# EAGLE design SkyProbe Main REV1A (EAGLE 7.4.0)
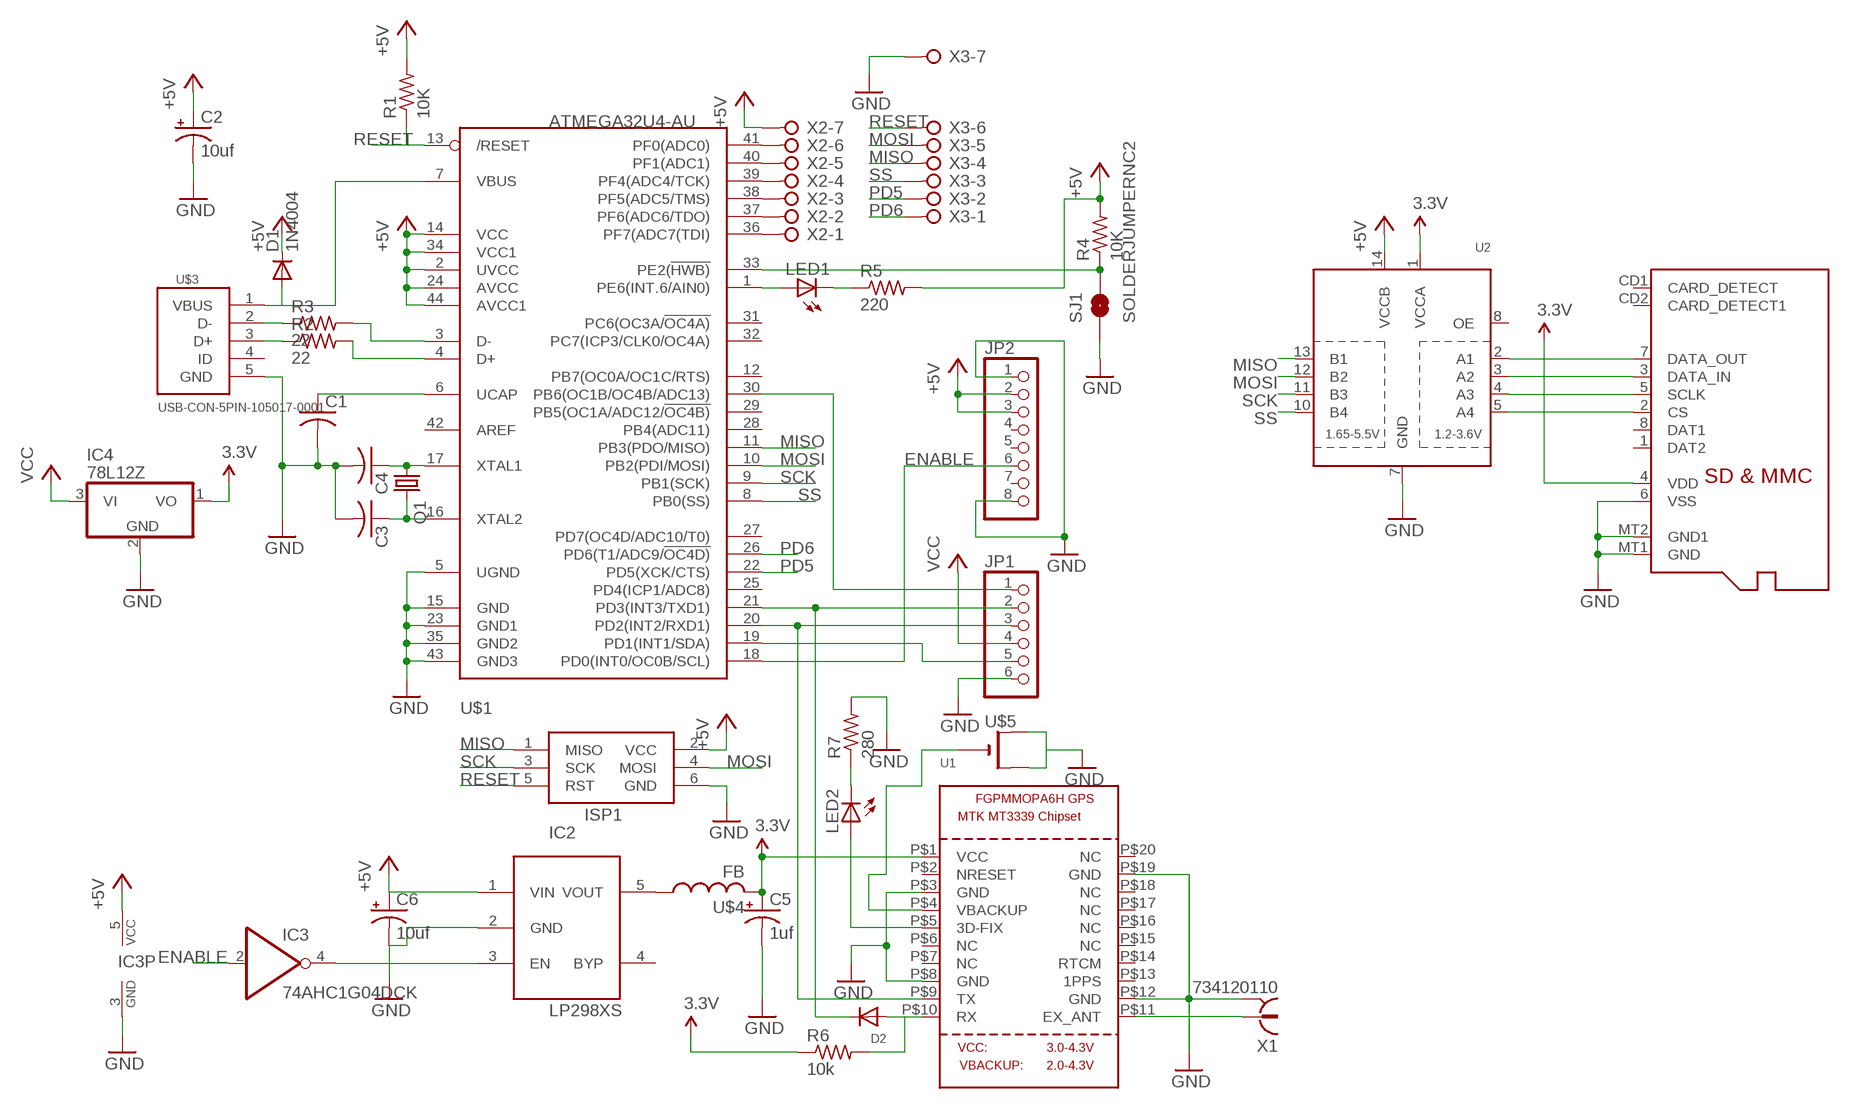
[diagram p0: schematic, sheet 1]

## Parts
C1  C-USC0805  [C0805]
C2  10uf  CPOL-US140CLH-0810  [140CLH-0810]
C3  C-USC0805  [C0805]
C4  C-USC0805  [C0805]
C5  1uf  CAP_POLSMD  [VISHAY_C]
C6  10uf  CAP_POLSMD  [VISHAY_C]
D1  1N4004  [DO41-10]
D2  DIODESOT23_WAVE  [SOT23-W]
IC2  LP298XS  [SOT23-5L]
IC3  74AHC1G04DCK  [SC70-5]
IC4  78L12Z  [TO92]
ISP1  AVRISP-6  [AVRISP]
JP1  PINHD-1X6  [1X06]
JP2  PINHD-1X8CLEANBIG  [1X08-CLEANBIG]
LED1  LEDB155  [Q62902-B155]
LED2  LEDCHIPLED_0603  [CHIPLED_0603]
Q1  CRYSTALCTS406  [CTS406]
R1  10K  R-US_R0805  [R0805]
R2  22  R-US_R0805  [R0805]
R3  22  R-US_R0805  [R0805]
R4  10K  R-US_R0805  [R0805]
R5  220  R-US_R0805  [R0805]
R6  10k  R-US_M0805  [M0805]
R7  280  R-US_M0805  [M0805]
SJ1  SOLDERJUMPERNC2  [SJ_2S-NOTRACE]
U1  GPS_FGPMMOPA6H  [FGPMMOPA6H]
U2  TXB0104PWR  [TSSOP14]
U$1  ATMEGA32U4-AU  [TQFP44]
U$3  USB-CON-5PIN-105017-0001  [USB-MICRO-MOLEX-105017-0001]
U$4  FB  [FB]
U$5  CR1220SMT  [CR1220-SMD]
U$6  MICROSD  [MICROSD]
X1  734120110  [734120110]
X2  W237-07P  [W237-7P]
X3  W237-07P  [W237-7P]

## Nets
3.3V: C5.+ IC4.1(VO) R6.1 U1.P$1(VCC) U2.1(VCCA) U$4.P$2
+5V: C2.+ C6.+ D1.C IC2.1(VIN) IC3.5(VCC) ISP1.2(VCC) JP2.2 JP2.3 R1.2 R4.2 R5.2 U2.14(VCCB) U$1.2(UVCC) U$1.14(VCC) U$1.24(AVCC) U$1.34(VCC1) U$1.44(AVCC1) X2.7
ENABLE: IC3.2(I) JP2.6 U$1.18(PD0(INT0/OC0B/SCL))
GND: C1.2 C2.- C3.2 C4.2 C5.- C6.- IC2.2(GND) IC3.3(GND) IC4.2(GND) ISP1.6(GND) JP1.6 JP2.1 JP2.8 R7.2 SJ1.1 U1.P$3(GND) U1.P$8(GND) U1.P$12(GND) U1.P$19(GND) U2.7(GND) U$1.5(UGND) U$1.15(GND) U$1.23(GND1) U$1.35(GND2) U$1.43(GND3) U$3.5(GND) U$5.+$1(+) U$5.+$2(+1) U$6.6(VSS) U$6.MT1(GND) U$6.MT2(GND1) X1.S@1 X1.S@2 X1.S@3 X3.7
MISO: ISP1.1(MISO) U2.13(B1) U$1.11(PB3(PDO/MISO)) X3.4
MOSI: ISP1.4(MOSI) U2.12(B2) U$1.10(PB2(PDI/MOSI)) X3.5
N$1: C1.1 U$1.6(UCAP)
N$2: R2.1 U$3.3(D+)
N$3: R3.2 U$1.3(D-)
N$4: C4.1 Q1.1 U$1.17(XTAL1)
N$5: C3.1 Q1.3 U$1.16(XTAL2)
N$6: R2.2 U$1.4(D+)
N$7: R3.1 U$3.2(D-)
N$8: D1.A U$1.7(VBUS) U$3.1(VBUS)
N$9: D2.3(C) JP1.2 U$1.21(PD3(INT3/TXD1))
N$10: JP1.3 U1.P$9(TX) U$1.20(PD2(INT2/RXD1))
N$11: R4.1 SJ1.2 U$1.33(PE2(!HWB))
N$12: JP1.5 U$1.19(PD1(INT1/SDA))
N$13: JP1.1 U$1.30(PB6(OC1B/OC4B/ADC13))
N$14: LED1.A U$1.1(PE6(INT.6/AIN0))
N$15: LED1.K(C) R5.1
N$16: D2.1(A) R6.2 U1.P$10(RX)
N$17: U$1.41(PF0(ADC0)) X2.6
N$18: U$1.40(PF1(ADC1)) X2.5
N$19: U$1.39(PF4(ADC4/TCK)) X2.4
N$20: U$1.38(PF5(ADC5/TMS)) X2.3
N$21: U$1.37(PF6(ADC6/TDO)) X2.2
N$22: U$1.36(PF7(ADC7(TDI)) X2.1
N$23: U1.P$4(VBACKUP) U$5.-
N$24: IC2.5(VOUT) U$4.P$1
N$25: U1.P$11(EX_ANT) X1.1
N$26: LED2.A U1.P$5(3D-FIX)
N$27: LED2.C R7.1
N$28: IC2.3(EN) IC3.4(O)
N$29: U2.2(A1) U$6.7(DATA_OUT)
N$30: U2.3(A2) U$6.3(DATA_IN)
N$31: U2.4(A3) U$6.5(SCLK)
N$32: U2.5(A4) U$6.2(CS)
PD5: U$1.22(PD5(XCK/CTS)) X3.2
PD6: U$1.26(PD6(T1/ADC9/!OC4D)) X3.1
RESET: ISP1.5(RST) R1.1 U$1.13(/RESET) X3.6
SCK: ISP1.3(SCK) U2.11(B3) U$1.9(PB1(SCK))
SS: U2.10(B4) U$1.8(PB0(SS)) X3.3
VCC: IC4.3(VI) JP1.4
VDD: U$6.4(VDD) ; supply symbol labelled 3.3V
Unconnected: IC2.4(BYP) JP2.4 JP2.5 JP2.7 U1.P$2(NRESET) U1.P$6(NC) U1.P$7(NC) U1.P$13(1PPS) U1.P$14(RTCM) U1.P$15(NC) U1.P$16(NC) U1.P$17(NC) U1.P$18(NC) U1.P$20(NC) U2.8(OE) U$1.12(PB7(OC0A/OC1C/RTS)) U$1.25(PD4(ICP1/ADC8)) U$1.27(PD7(OC4D/ADC10/T0)) U$1.28(PB4(ADC11)) U$1.29(PB5(OC1A/ADC12/!OC4B)) U$1.31(PC6(OC3A/!OC4A)) U$1.32(PC7(ICP3/CLK0/OC4A)) U$1.42(AREF) U$3.4(ID) U$6.1(DAT2) U$6.8(DAT1) U$6.CD1(CARD_DETECT) U$6.CD2(CARD_DETECT1)

## Library data of the parts
C1 C3 C4 = rcl:C-US: CAPACITOR, American symbol
C2 = rcl:CPOL-US: POLARIZED CAPACITOR, American symbol
C5 C6 = SparkFun-Capacitors:CAP_POL: Capacitor Polarized These are standard SMD and PTH capacitors. Normally 10uF, 47uF, and 100uF in electrolytic and tantalum varieties. Always verify the external diameter of the through hole cap, it varies with capacity, voltage, and manufacturer. The EIA devices should be standard.
D1 = adafruit:1N4004: DIODE General purpose 1N400x type rectifier (With bigger pads) http://www.ladyada.net/library/pcb/eaglelibrary.html
D2 = adafruit:DIODE: Diode SMADIODE - SMA Surface Mount Package 20V 1A Schottky Diode Digikey: 641-1014-6-ND DO-1N4148 - Through Hole Small Current Diode SOD-123 20V 1 A (.5mV Vf) Schottky Diode - Digikey: MBRX120TPMSCT-ND SOD-323 10V 570mA (.38mV Vf, 3ns) Schottky Diode - Digikey: ZLLS410CT-ND SOD-523 30V 30mA Schottky Diode (RB751S-40TE61) - Digikey: RB751S-40TE61CT-ND SOT23-R/W - SOT23 Package (R = Solder Paste/Reflow Ovens, W = Hand-Soldering) BAT54Film 40V 300mA - Digikey: 497-7162-1-ND
IC2 = adafruit:LP298X
IC3 = 74xx-little-de:74*1G04: INVERTER Gate
IC4 = adafruit:78*: Positive VOLTAGE REGULATOR Added bigger pads to the TO-92 package
ISP1 = adafruit:AVRISP: AVR ISP HEADER Standard 6 pin header for AVR programming
JP1 = adafruit:PINHD-1X6: PIN HEADER
JP2 = adafruit:PINHD-1X8: PIN HEADER
LED1 LED2 = adafruit:LED: LED OSRAM: - CHIPLED LG R971, LG N971, LY N971, LG Q971, LY Q971, LO R971, LY R971 LH N974, LH R974 LS Q976, LO Q976, LY Q976 LO Q996 - Hyper CHIPLED LW Q18S LB Q993, LB Q99A, LB R99A - SideLED LS A670, LO A670, LY A670, LG A670, LP A670 LB A673, LV A673, LT A673, LW A673 LH A674 LY A675 LS A676, LA A676, LO A676, LY A676, LW A676 LS A679, LY A679, LG A679 - Hyper Micro SIDELED® LS Y876, LA Y876, LO Y876, LY Y876 LT Y87S - SmartLED LW L88C, LW L88S LB L89C, LB L89S, LG L890 LS L89K, LO L89K, LY L89K LS L896, LA L896, LO L896, LY L896 - TOPLED LS T670, LO T670, LY T670, LG T670, LP T670 LSG T670, LSP T670, LSY T670, LOP T670, LYG T670 LG T671, LOG T671, LSG T671 LB T673, LV T673, LT T673, LW T673 LH T674 LS T676, LA T676, LO T676, LY T676, LB T676, LH T676, LSB T676, LW T676 LB T67C, LV T67C, LT T67C, LS T67K, LO T67K, LY T67K, LW E67C LS E67B, LA E67B, LO E67B, LY E67B, LB E67C, LV E67C, LT E67C LW T67C LS T679, LY T679, LG T679 LS T770, LO T770, LY T770, LG T770, LP T770 LB T773, LV T773, LT T773, LW T773 LH T774 LS E675, LA E675, LY E675, LS T675 LS T776, LA T776, LO T776, LY T776, LB T776 LHGB T686 LT T68C, LB T68C - Hyper Mini TOPLED® LB M676 - Mini TOPLED Santana® LG M470 LS M47K, LO M47K, LY M47K Source: http://www.osram.convergy.de/
Q1 = adafruit:CRYSTAL: CRYSTAL; OC_FARNELL: unknown; OC_NEWARK: unknown
R1-R7 = rcl:R-US_: RESISTOR, American symbol
SJ1 = SparkFun-Retired:SOLDERJUMPER: Solder Jumper Standard SMD solder jumper. Used to automate production. Two varients : Normally Open and Normally Closed are the same, but have different paste layers. NC will have a large amount of paste and should jumper during reflow.
U1 = adafruit:GPS_FGPMMOPA6H: GPS Module - MTK MT3339 Chipset, -165dBm sensitivity, 22 channels, 10Hz, auto-select external antenna options
U2 = adafruit:TXB0104PWR: 4-Bit Bi-Directional Level Shifter 1.2V-3.6V (VCCA) to 1.65V-5.5V (VCCB) bi-directional level shifter with auto direction sensing. Max data rate - VCCA 1.8V: 20Mbps (50ns), VCCA 3.3V: 100Mbps (10ns) Digikey: 296-21929-1-ND
U$1 = adafruit:ATMEGA32U4: http://www.ladyada.net/library/eagle
U$3 = GeekAmmo:USB-CON-5PIN: Molex Micro USB 105017-0001
U$4 = adafruit:FB: Ferrite bead Digikey #P9821BK-ND
U$5 = adafruit:CR1220: CR1216/CR1220/CR1225 12mm 3V lithium coin cell Great for battery packup. Both SMT and THM holders. Note the THM package has the ground pads on both sides of the PCB so that the masks are the same - this reduces the cost
U$6 = adafruit:MICROSD: Micro-SD / Transflash card holder with SPI pinout For the 3M # 2908-05WB-MG and/or 4UCON #19656 push-push type
X1 = con-coax:734120110: MICRO COAXIAL CONNECTOR RECEPTACLE VERTICAL Source: Data sheet <http://www.molex.com/pdm_docs/sd/734120110_sd.pdf>
X2 X3 = con-wago-508:W237-07P: WAGO SREW CLAMP; OC_FARNELL: unknown; OC_NEWARK: unknown

## Board
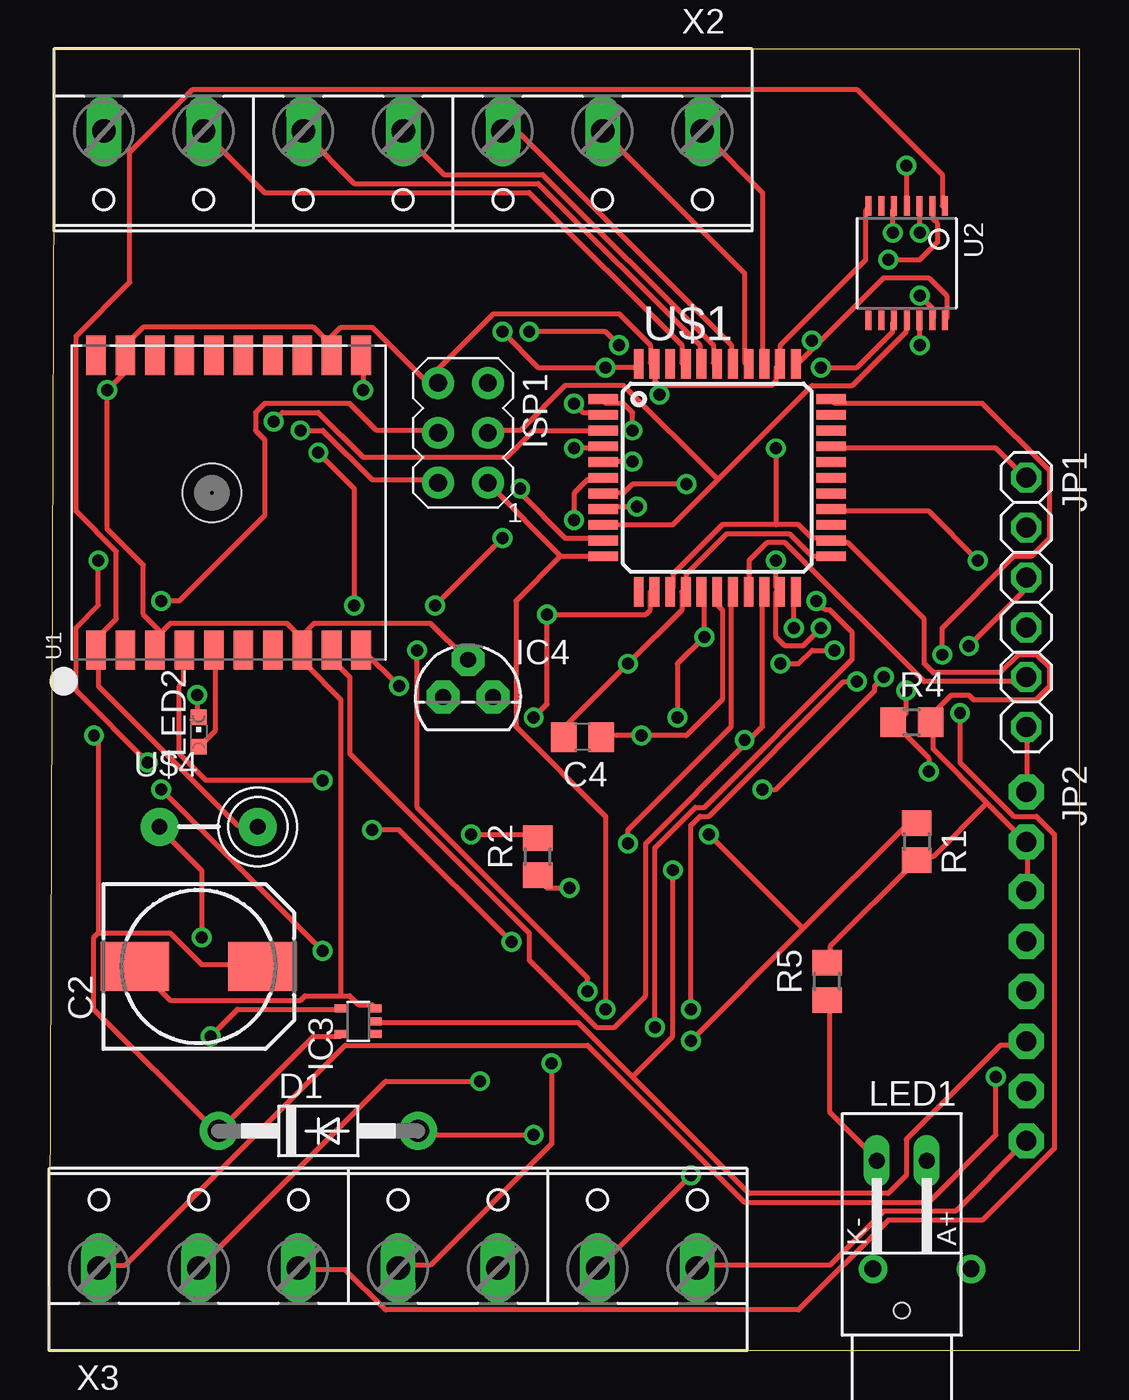
[diagram p1: board, top side]
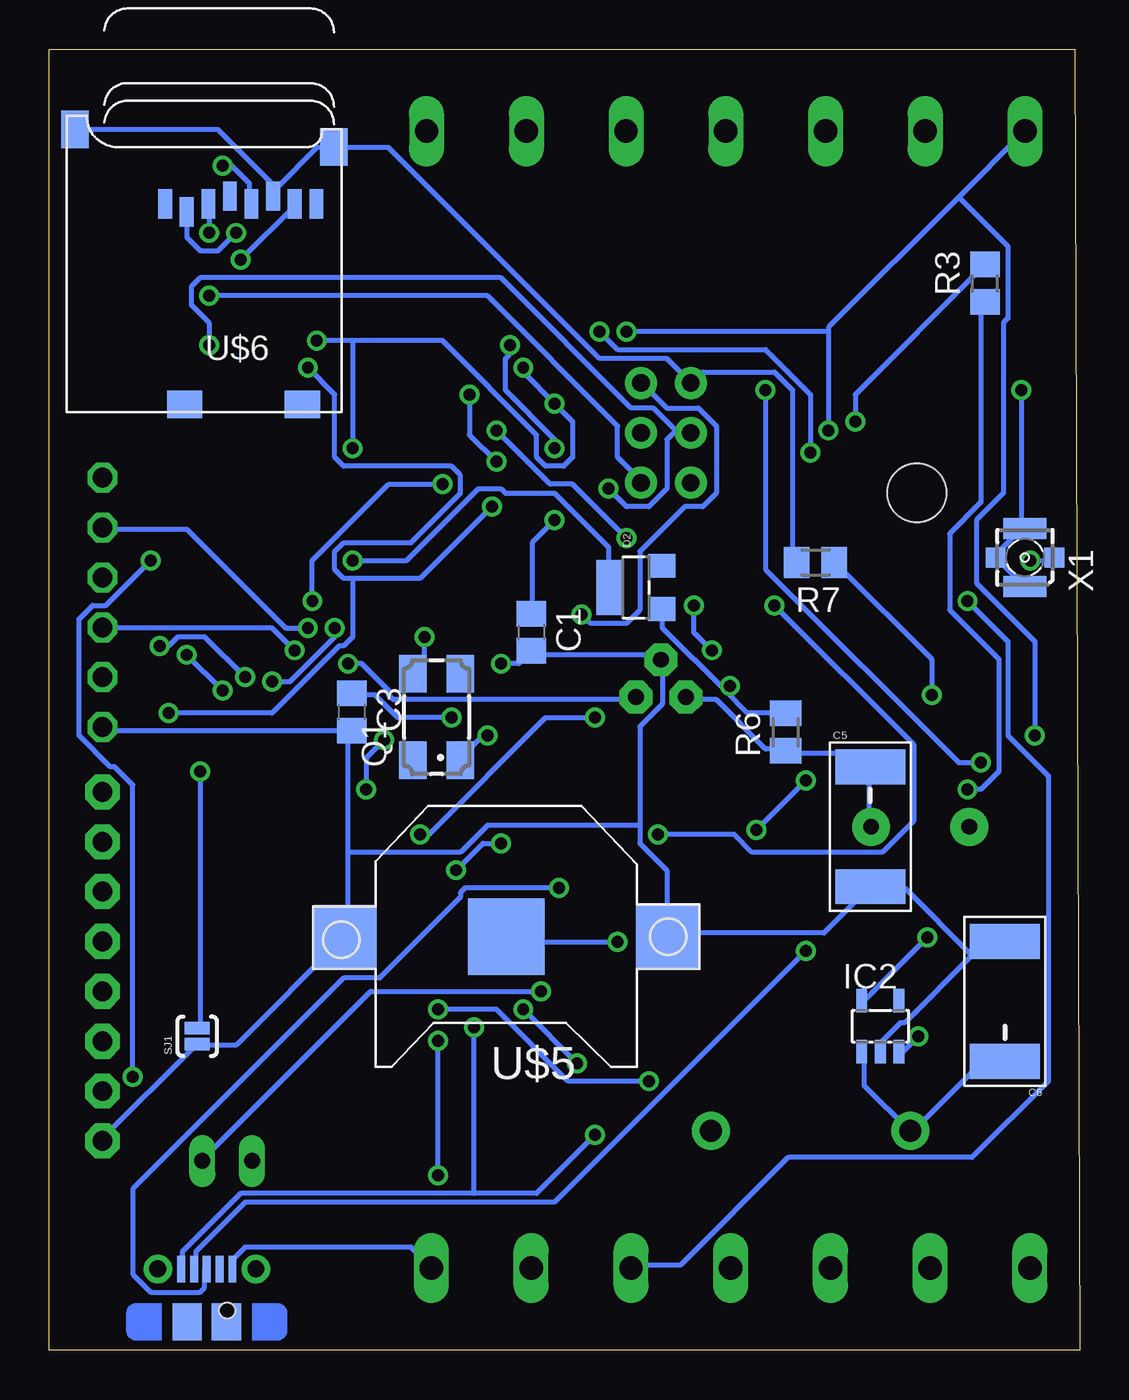
[diagram p2: board, bottom side, seen from below]

Size 52.5 x 66.28 mm. Coordinates in mm from the lower left corner, seen from the top.
Outline: 0,0 52.5,0 52.5,66.28 0.25,66.28 0,0
Copper layers (1*16): Top 0.035mm / dielectric 1.5mm / Bottom 0.035mm
Design rules "default": minimum track width 10mil, minimum drill 24mil, track to track 8mil, track to pad 8mil, pad to pad 8mil, via to via 8mil, smd to smd 8mil, copper to edge 40mil, drill to drill 8mil, minimum pad ring 10mil, minimum via ring 8mil, stop-mask expansion 4mil, vias tented up to drill 0mil, thermal gap 10mil

### Footprints (pad centres in the part's own frame; a part is rotated, then mirrored left to right if it is on the bottom)
C0805 = smd 1.3 x 1.5: 1 -0.95,0; 2 0.95,0
140CLH-0810 = smd 3.5 x 2.5: + 3.25,0; - -3.25,0
VISHAY_C = smd 3.556 x 1.778: + 0,3.048; - 0,-3.048
DO41-10 = drill 1.118 pad 1.93: A 5.08,0; C -5.08,0
SOT23-W = smd 1.2 x 1.4: 1 -1.1,-1.3; 2 1.1,-1.3 | smd 2.8 x 1.4: 3 0,1.3
SOT23-5L = smd 0.55 x 1.2: 1 -0.95,-1.3; 2 0,-1.3; 3 0.95,-1.3; 4 0.95,1.3; 5 -0.95,1.3
SC70-5 = smd 0.4 x 0.7: 1 -0.65,-0.85; 2 0,-0.85; 3 0.65,-0.85; 4 0.65,0.85; 5 -0.65,0.85
TO92 = drill 0.813 pad 1.676 octagon: 1 -1.27,0; 2 0,1.905; 3 1.27,0
AVRISP = drill 0.9 pad 1.626: 1 -1.27,2.54; 2 1.27,2.54; 3 -1.27,0; 4 1.27,0; 5 -1.27,-2.54; 6 1.27,-2.54
1X06 = drill 1.016 octagon: 1 -6.35,0; 2 -3.81,0; 3 -1.27,0; 4 1.27,0; 5 3.81,0; 6 6.35,0
1X08-CLEANBIG = drill 1.016 pad 1.778 octagon: 1 -8.89,0; 2 -6.35,0; 3 -3.81,0; 4 -1.27,0; 5 1.27,0; 6 3.81,0; 7 6.35,0; 8 8.89,0
Q62902-B155 = drill 0.813 long: A 7.62,-1.27; K 7.62,1.27 | hole 0.813: 0,0
CHIPLED_0603 = smd 0.8 x 0.8: A 0,-0.75; C 0,0.75
CTS406 = smd 1.9 x 1.4: 1 -2.2,-1.2; 2 2.2,-1.2; 3 2.2,1.2; 4 -2.2,1.2
R0805 = smd 1.3 x 1.5: 1 -0.95,0; 2 0.95,0
M0805 = smd 1.3 x 1.6: 1 -0.95,0; 2 0.95,0
SJ_2S-NOTRACE = smd 0.635 x 1.27: 1 -0.401,0; 2 0.413,0
FGPMMOPA6H = smd 2 x 1: P$1 -7.5,6.75; P$2 -7.5,5.25; P$3 -7.5,3.75; P$4 -7.5,2.25; P$5 -7.5,0.75; P$6 -7.5,-0.75; P$7 -7.5,-2.25; P$8 -7.5,-3.75; P$9 -7.5,-5.25; P$10 -7.5,-6.75; P$11 7.5,-6.75; P$12 7.5,-5.25; P$13 7.5,-3.75; P$14 7.5,-2.25; P$15 7.5,-0.75; P$16 7.5,0.75; P$17 7.5,2.25; P$18 7.5,3.75; P$19 7.5,5.25; P$20 7.5,6.75 | hole 3: 0.5,0.85
TSSOP14 = smd 0.305 x 0.991: 1 -1.95,-2.918; 2 -1.3,-2.918; 3 -0.65,-2.918; 4 0,-2.918; 5 0.65,-2.918; 6 1.3,-2.918; 7 1.95,-2.918; 8 1.95,2.918; 9 1.3,2.918; 10 0.65,2.918; 11 0,2.918; 12 -0.65,2.918; 13 -1.3,2.918; 14 -1.95,2.918
TQFP44 = smd 1.5 x 0.5: 1 -5.8,4; 2 -5.8,3.2; 3 -5.8,2.4; 4 -5.8,1.6; 5 -5.8,0.8; 6 -5.8,0; 7 -5.8,-0.8; 8 -5.8,-1.6; 9 -5.8,-2.4; 10 -5.8,-3.2; 11 -5.8,-4; 23 5.8,-4; 24 5.8,-3.2; 25 5.8,-2.4; 26 5.8,-1.6; 27 5.8,-0.8; 28 5.8,0; 29 5.8,0.8; 30 5.8,1.6; 31 5.8,2.4; 32 5.8,3.2; 33 5.8,4 | smd 0.5 x 1.5: 12 -4,-5.8; 13 -3.2,-5.8; 14 -2.4,-5.8; 15 -1.6,-5.8; 16 -0.8,-5.8; 17 0,-5.8; 18 0.8,-5.8; 19 1.6,-5.8; 20 2.4,-5.8; 21 3.2,-5.8; 22 4,-5.8; 34 4,5.8; 35 3.2,5.8; 36 2.4,5.8; 37 1.6,5.8; 38 0.8,5.8; 39 0,5.8; 40 -0.8,5.8; 41 -1.6,5.8; 42 -2.4,5.8; 43 -3.2,5.8; 44 -4,5.8
USB-MICRO-MOLEX-105017-0001 = smd 0.4 x 1.35: 1 1.2,0; 2 1.85,0; 3 2.5,0; 4 3.15,0; 5 3.8,0 | drill 0.85 pad 1.45: P$1 0,0; P$2 5,0 | smd 1.5 x 1.9: P$3 3.5,-2.7; P$4 1.5,-2.7
FB = drill 0.8 pad 1.93: P$1 -2.5,0; P$2 2.5,0
CR1220-SMD = smd 3.2 x 3.2: +$1 -8.2,0; +$2 8.2,0 | smd 3.9 x 3.9: - 0,0
MICROSD = smd 0.7 x 1.5: 1 9,-10.64; 2 7.9,-10.24; 3 6.8,-10.64; 4 5.7,-11.04; 5 4.6,-10.64; 6 3.5,-11.04; 7 2.4,-10.64; 8 1.3,-10.64 | smd 1.8 x 1.4: CD1 2,-0.44; CD2 8,-0.44 | smd 1.4 x 1.9: MT1 0.4,-13.54; MT2 13.6,-14.44
734120110 = smd 1 x 1: 1 0,-1.5; S@1 0,1.5 | smd 1.05 x 2.2: S@2 -1.475,0; S@3 1.475,0
W237-7P = drill 1.194 long: 1 -15.24,-0.635; 2 -10.16,-0.635; 3 -5.08,-0.635; 4 0,-0.635; 5 5.08,-0.635; 6 10.16,-0.635; 7 15.24,-0.635

### Placement (x,y rotation side)
C1  27.94,36.58 270 bottom
C2  7.62,19.56 0 top
C3  37.08,32.51 270 bottom
C4  27.18,31.24 180 top
C5  10.67,26.67 0 bottom
C6  3.81,17.78 180 bottom
D1  13.72,11.18 0 top
D2  22.61,38.86 90 bottom
IC2  10.16,16.51 0 bottom
IC3  15.75,16.76 90 top
IC4  21.34,33.27 0 top
ISP1  21.08,46.74 180 top
JP1  49.78,38.1 270 top
JP2  49.78,19.56 270 top
LED1  43.43,2.03 90 top
LED2  7.62,31.5 0 top
Q1  32.77,32.26 90 bottom
R1  44.2,25.91 270 top
R2  24.89,25.15 90 top
R3  4.83,54.36 90 bottom
R4  43.94,32 0 top
R5  39.62,18.8 90 top
R6  14.99,31.5 90 bottom
R7  13.46,40.13 180 bottom
SJ1  44.96,16 90 bottom
U1  9.14,43.18 90 top
U2  43.69,55.37 180 top
U$1  34.04,44.45 0 top
U$3  46.97,4.16 0 bottom
U$4  8.13,26.67 0 top
U$5  29.21,21.08 180 bottom
U$6  37.59,47.75 180 bottom
X1  2.79,40.39 90 bottom
X2  18.03,61.47 180 top
X3  17.78,4.83 0 top

### Tracks (layer width: path | path; a pad name or v marks a point on that pad's centre or on a via)
3.3V
  Top 0.254: U2.1 45.49,58.29 45.49,59.89 41.15,64.24 7.32,64.24 4.12,61.04 4.12,54.41 1.37,51.66 1.37,42.75 3.43,40.69 3.43,37.26 2.52,36.35 2.52,35.89 U1.P$1 2.52,35.66 2.52,33.83 9.6,26.75 10.52,26.75 U$4.P$2
  Bottom 0.254: 10.74,29.72 11.43,30.4 14.86,30.4 R6.1 15.09,30.63 16,30.63 18.52,33.15 19.89,33.15 IC4.1 | 10.74,29.72 10.74,26.75 U$4.P$2 | 10.74,29.72 C5.+
+5V  (via drill 0.61)
  Top 0.254: 37.03,42.06 38.18,42.06 38.86,41.38 39.78,41.38 U$1.24 40.01,41.15 40.69,41.15 44.58,37.26 44.58,34.98 45.03,34.52 48.46,34.52 49.38,35.43 50.29,35.43 50.98,34.75 50.98,33.83 50.29,33.15 47.09,33.15 46.86,33.38 45.95,33.38 45.03,32.46 45.03,32 | 37.03,42.06 34.29,42.06 31.77,39.55 31.77,38.86 U$1.14 | R5.2 39.78,19.89 39.78,20.57 44.12,24.92 R1.2 44.35,25.15 45.03,25.15 47.78,27.89 | 45.03,32 45.03,30.63 47.78,27.89 | 47.78,27.89 49.61,26.06 JP2.2 49.84,25.83 49.84,23.55 JP2.3 | 45.03,32 R4.2 | IC3.5 14.86,16 13.49,16 8.69,11.2 D1.C 8.46,11.2 2.29,17.37 2.29,21.03 2.52,21.26 | 2.52,21.26 6.17,21.26 7.77,19.66 10.74,19.66 C2.+ | 39.09,51.21 38.18,50.29 U$1.34 | 39.09,51.21 42.52,54.63 44.81,54.63 45.72,53.72 45.72,52.58 U2.14 | v26.75,48.23 27.2,47.78 28.12,47.78 U$1.2 | U$1.44 29.95,50.06 v28.35,50.06 24.92,50.06 v23.09,51.89 | v12.8,46.86 13.95,46.86 16.46,44.35 19.66,44.35 ISP1.2 | v38.86,51.44 39.09,51.21 | 2.52,21.26 2.52,31.09 v2.29,31.32 | v37.03,45.95 37.03,42.06
  Bottom 0.254: IC2.1 10.97,15.09 10.97,13.49 8.69,11.2 D1.C 8.46,11.2 5.03,14.63 3.89,14.63 C6.+ | v28.35,50.06 28.35,49.84 v26.75,48.23 25.83,47.32 25.83,45.49 26.29,45.03 27.2,45.03 27.66,45.49 27.66,46.63 32.46,51.44 37.03,51.44 | 12.8,51.89 12.8,52.12 6.17,58.75 | 12.8,51.89 v12.8,46.86 | 6.17,58.75 2.97,61.95 X2.7 | 12.8,51.89 v23.09,51.89 | 37.03,51.44 v38.86,51.44 | v2.29,31.32 2.29,36.12 5.26,39.09 5.26,42.29 3.89,43.66 3.89,52.35 3.66,52.58 3.66,56.24 6.17,58.75 | 37.03,51.44 v37.03,45.95
ENABLE  (via drill 0.61)
  Top 0.254: 29.72,13.95 35.66,8 42.75,8 43.66,8.91 43.66,10.74 48.46,15.54 49.61,15.54 JP2.6 | 29.72,13.95 26.98,16.69 16.69,16.69 IC3.2 | v29.49,25.83 29.49,26.52 34.75,31.77 34.75,38.63 U$1.18 | v31.77,24.46 31.77,16 29.72,13.95
  Bottom 0.254: v29.49,25.83 30.4,25.83 v31.77,24.46
GND  (via drill 0.61)
  Top 0.254: v29.72,45.26 28.35,45.26 U$1.5 | 31.09,49.15 30.86,49.38 30.86,50.06 U$1.43 30.63,50.29 30.63,51.21 29.03,52.81 22.63,52.81 19.89,50.06 19.89,49.38 ISP1.6 19.66,49.38 19.2,49.38 16.46,52.12 14.86,52.12 14.17,51.44 | U2.7 41.6,58.06 41.6,55.55 37.26,51.21 37.26,50.29 U$1.35 37.03,50.06 37.03,49.38 36.8,49.15 31.09,49.15 | 31.09,49.15 v31.09,48.69 | 14.17,51.44 13.49,52.12 4.8,52.12 4.12,51.44 4.12,50.75 U1.P$19 3.89,50.52 3.89,49.84 v2.97,48.92 2.97,41.83 4.8,40.01 4.8,37.49 5.71,36.58 | 14.17,51.44 14.17,50.75 U1.P$12 14.17,51.44 | JP1.6 49.84,31.55 49.84,28.57 JP2.1 | X3.7 33.15,4.34 39.78,4.34 42.52,7.09 46.18,7.09 49.61,10.52 JP2.8 | C4.2 26.29,31.32 26.29,31.77 v29.49,34.98 32.23,37.72 32.23,38.63 U$1.15 32.46,38.86 32.46,39.55 34.52,41.6 37.72,41.6 38.86,40.46 39.78,40.46 U$1.23 | 14.86,18.06 13.03,18.06 12.8,17.83 6.17,17.83 4.57,19.43 C2.- | 14.86,18.06 15.32,18.06 15.77,17.6 16.46,17.6 IC3.3 | 5.71,36.58 6.17,37.03 12.12,37.03 12.8,36.35 | 5.71,36.58 5.49,36.35 5.49,35.89 U1.P$3 5.71,36.58 | 12.8,36.35 12.8,35.89 U1.P$8 | 12.8,36.35 13.49,37.03 19.43,37.03 21.26,35.2 IC4.2 | 12.8,36.35 U1.P$8 | 14.86,18.06 14.86,33.15 13.03,34.98 13.03,35.66 U1.P$8
  Bottom 0.254: v29.72,45.26 31.09,46.63 v31.09,48.69 | 40.92,59.21 40.92,58.98 U$6.6 40.92,59.21 | 40.92,59.21 38.86,61.27 38.18,61.27 U$6.MT1 37.95,61.27 35.2,61.27 24.46,50.52 21.03,50.52 19.89,49.38 ISP1.6 19.66,49.38 19.2,49.84 15.54,49.84 14.63,48.92 14.63,40.23 R7.2 | 40.92,59.21 43.89,62.18 50.98,62.18 U$6.MT2 | X1.S@2 2.97,39.09 4.12,40.23 X1.S@1 4.34,40.46 2.97,41.83 X1.S@3 2.97,42.06 v2.97,48.92 | U$3.5 43.2,4.34 43.2,4.57 42.52,5.26 34.06,5.26 33.15,4.34 X3.7 | JP2.8 49.84,10.74 45.03,15.54 SJ1.1 44.81,15.54 42.98,15.54 37.49,21.03 U$5.+$2 37.26,21.26 37.26,25.38 | 37.26,25.38 37.26,31.55 | 37.26,31.55 49.61,31.55 JP1.6 | 37.26,31.55 C3.2 | 5.49,20.12 4.8,20.8 3.89,20.8 C6.- 5.49,20.12 | 5.49,20.12 8.91,16.69 9.14,16.69 10.06,15.77 10.06,15.32 IC2.2 | 5.49,20.12 8.91,23.55 10.52,23.55 C5.- 13.03,21.26 20.8,21.26 U$5.+$1 21.03,21.26 21.03,24.46 22.4,25.83 22.4,26.75 | v29.49,34.98 28.57,34.98 28.12,35.43 C1.2 27.89,35.43 21.72,35.43 21.49,35.2 IC4.2 21.26,34.98 21.26,32.92 22.4,31.77 22.4,26.75 | 37.26,25.38 31.55,25.38 30.18,26.75 22.4,26.75
MISO  (via drill 0.61)
  Top 0.254: v44.35,53.72 45.03,53.03 45.03,52.58 U2.13 | 26.06,40.46 28.12,40.46 U$1.11 | 26.06,40.46 22.4,44.12 ISP1.1 | v25.6,14.63 25.6,10.52 19.43,4.34 17.83,4.34 X3.4 | v28.35,17.37 28.35,27.2 23.77,31.77 23.77,38.18 26.06,40.46
  Bottom 0.254: v44.35,53.72 30.18,53.72 23.55,47.09 23.55,45.49 22.4,44.35 ISP1.1 | v28.35,17.37 v25.6,14.63
MOSI  (via drill 0.61)
  Top 0.254: v44.35,51.21 44.35,52.35 U2.12 | v24,43.89 24,43.66 26.29,41.38 28.12,41.38 U$1.10 | v5.71,38.18 6.63,38.18 10.97,42.52 10.97,46.41 10.52,46.86 10.52,47.78 10.97,48.23 15.32,48.23 16.69,46.86 19.66,46.86 ISP1.4
  Bottom 0.254: v44.35,51.21 44.35,52.35 45.26,53.26 45.26,54.18 44.81,54.63 29.49,54.63 22.86,48.01 21.72,48.01 20.57,46.86 | 20.57,46.86 19.89,46.86 ISP1.4 20.57,46.86 | v24,43.89 23.09,42.98 21.95,42.98 21.03,43.89 21.03,46.41 20.57,46.86 | v5.71,38.18 3.66,36.12 3.66,31.32 1.6,29.26 1.6,13.72 5.49,9.83 14.86,9.83 20.34,4.34 22.86,4.34 X3.5
N$1  (via drill 0.61)
  Top 0.254: v26.75,42.29 26.75,43.66 27.43,44.35 28.12,44.35 U$1.6
  Bottom 0.254: v26.75,42.29 27.89,41.15 27.89,37.72 C1.1
N$2  (via drill 0.61)
  Top 0.254: v26.52,23.55 25.38,23.55 24.92,24 R2.1
  Bottom 0.254: v26.52,23.55 31.32,23.55 31.55,23.32 31.55,23.09 35.66,18.97 37.49,18.97 48.23,8.23 48.23,3.89 47.32,2.97 44.81,2.97 44.58,3.2 44.58,4.12 U$3.3
N$3  (via drill 0.61)
  Top 0.254: v11.43,47.32 11.89,47.78 13.72,47.78 16,45.49 23.32,45.49 24.69,46.86 28.12,46.86 U$1.3
  Bottom 0.254: v11.43,47.32 11.43,48.69 5.03,55.09 R3.2
N$4  (via drill 0.61)
  Top 0.254: C4.1 28.35,31.32 v30.18,31.32 32.46,31.32 34.29,33.15 34.29,37.72 34.06,37.95 34.06,38.63 U$1.17
  Bottom 0.254: v30.18,31.32 30.4,31.32 31.55,30.18 Q1.1
N$5  (via drill 0.61)
  Top 0.254: U$1.16 33.38,38.63 v33.38,36.35 32,34.98 v32,32.23
  Bottom 0.254: v33.38,36.35 33.38,34.98 33.83,34.52 Q1.3 | v32,32.23 34.75,32.23 35.89,33.38 37.03,33.38 C3.1
N$6  (via drill 0.61)
  Top 0.254: v21.49,26.29 24.69,26.29 R2.2 | v15.54,37.95 15.54,43.89 v13.72,45.72 | v24.46,51.89 28.35,51.89 v29.03,51.21 | v26.75,45.95 28.12,45.95 U$1.4
  Bottom 0.254: v21.49,26.29 17.6,26.29 16.69,25.38 10.06,25.38 8.46,26.98 8.46,30.86 v15.54,37.95 | v13.72,45.72 13.72,48.69 16,50.98 23.55,50.98 v24.46,51.89 | v29.03,51.21 29.03,50.75 29.26,50.52 29.26,48.92 26.75,46.41 v26.75,45.95
N$7  (via drill 0.61)
  Top 0.254: v5.71,28.57 v13.95,20.34
  Bottom 0.254: v13.95,20.34 26.75,7.54 42.52,7.54 45.03,5.03 45.03,4.34 U$3.2 | v5.71,28.57 5.03,28.57 4.12,29.49 4.12,35.2 6.63,37.72 6.63,41.6 5.03,43.2 5.03,53.26 R3.1
N$8  (via drill 0.61)
  Top 0.254: v24.69,10.97 18.97,10.97 D1.A | v32.46,44.12 29.72,44.12 29.26,43.66 28.35,43.66 U$1.7 | v39.09,38.18 39.55,37.72 39.78,37.72 40.92,36.58 40.92,35.2 33.38,27.66 32.92,27.66 30.86,25.6 v30.86,16.46
  Bottom 0.254: 30.86,8 27.66,8 v24.69,10.97 | 30.86,8 42.75,8 45.72,5.03 45.72,4.34 U$3.1 | v32.46,44.12 35.2,44.12 39.09,40.23 v39.09,38.18 | 30.86,8 v30.86,16.46
N$9  (via drill 0.61)
  Top 0.254: v39.32,36.8 38.41,35.89 37.49,35.89 37.03,36.35 37.03,38.63 U$1.21 37.03,38.86 v37.03,40.23
  Bottom 0.254: v39.32,36.8 40.46,36.8 45.49,41.83 49.61,41.83 JP1.2 | v37.03,40.23 34.29,40.23 30.63,43.89 29.49,43.89 29.26,43.66 26.75,43.66 24,40.92 24,38.86 D2.3
N$10  (via drill 0.61)
  Top 0.254: 35.66,31.09 30.4,25.83 30.4,18.06 28.8,16.46 27.89,16.46 24.46,19.89 24.46,21.26 15.32,30.4 15.32,34.29 14.4,35.2 14.4,35.66 U1.P$9 | 35.66,31.09 36.35,31.77 36.35,38.63 U$1.20 | v46.86,35.89 49.61,38.63 49.61,39.32 JP1.3 | v42.52,34.29 42.06,33.83 42.06,33.6 37.03,28.57 v36.35,28.57 | 35.66,31.09 v35.43,31.09
  Bottom 0.254: v46.86,35.89 46.41,35.89 45.95,36.35 44.58,36.35 v42.52,34.29 | v36.35,28.57 36.35,30.18 v35.43,31.09
N$11  (via drill 0.61)
  Top 0.254: v44.81,29.49 44.81,30.18 42.98,32 R4.1 43.2,32 43.66,32.46 v43.66,33.6 | v45.49,35.43 45.49,36.8 49.15,40.46 50.06,40.46 50.98,41.38 50.98,44.81 47.55,48.23 40.01,48.23 U$1.33
  Bottom 0.254: v44.81,29.49 44.81,16.46 SJ1.2 | v43.66,33.6 v45.49,35.43
N$12
  Top 0.254: U$1.19 35.66,38.86 35.66,40.23 36.58,41.15 37.49,41.15 44.58,34.06 49.38,34.06 49.61,34.29 JP1.5
N$13
  Top 0.254: U$1.30 40.01,45.95 48.23,45.95 49.61,44.58 JP1.1
N$14  (via drill 0.61)
  Top 0.254: v29.72,46.86 29.72,47.78 29.26,48.23 28.35,48.23 U$1.1 | v19.66,37.95 v23.09,41.38 | v18.75,35.66 18.75,27.66 27.43,18.97 v27.43,18.29
  Bottom 0.254: v29.72,46.86 26.98,44.12 25.83,44.12 v23.09,41.38 | v19.66,37.95 19.66,36.58 v18.75,35.66 | v27.43,18.29 36.12,18.29 44.58,9.83 LED1.A
N$15
  Top 0.254: R5.1 39.78,17.83 39.78,12.12 42.06,9.83 LED1.K
N$16  (via drill 0.61)
  Top 0.254: v17.83,33.83 16,35.66 U1.P$10
  Bottom 0.254: 18.06,33.6 16.92,32.46 15.09,32.46 R6.2 | 18.06,33.6 21.26,36.8 21.26,37.72 D2.1 | 18.06,33.6 v17.83,33.83
N$17
  Top 0.254: U$1.41 32.23,50.29 32.23,51.21 24.46,58.98 10.97,58.98 8,61.95 X2.6
N$18
  Top 0.254: U$1.40 33.15,50.29 33.15,51.21 24.92,59.44 15.54,59.44 13.03,61.95 X2.5
N$19
  Top 0.254: U$1.39 33.83,50.29 33.83,51.21 25.15,59.89 20.12,59.89 18.06,61.95 X2.4
N$20
  Top 0.254: U$1.38 34.75,50.29 34.75,51.21 24,61.95 23.32,61.95 X2.3
N$21
  Top 0.254: X2.2 35.43,54.86 35.43,50.29 U$1.37
N$22
  Top 0.254: U$1.36 36.35,50.29 36.35,58.98 33.38,61.95 X2.1
N$23  (via drill 0.61)
  Top 0.254: v13.95,29.03 8,29.03 6.63,30.4 6.63,33.83 6.86,34.06 6.86,35.66 U1.P$4 | v16.46,26.52 17.83,26.52 v23.55,20.8
  Bottom 0.254: v16.46,26.52 v13.95,29.03 | v23.55,20.8 28.8,20.8 29.03,21.03 U$5.-
N$24  (via drill 0.61)
  Top 0.254: v7.77,21.03 7.77,24.46 5.71,26.52 U$4.P$1
  Bottom 0.254: v7.77,21.03 10.97,17.83 IC2.5
N$25  (via drill 0.61)
  Top 0.254: v2.52,40.23 2.52,37.95 1.37,36.8 1.37,33.6 v5.03,29.95 | v16,48.92 16,50.52 U1.P$11
  Bottom 0.254: v2.52,40.23 1.37,40.23 X1.1 | v5.03,29.95 6.17,29.95 16,39.78 v16,48.92
N$26
  Top 0.254: LED2.A 7.77,30.86 8.46,31.55 8.46,35.66 U1.P$5
N$27  (via drill 0.61)
  Top 0.254: v7.54,33.38 7.54,32.46 LED2.C
  Bottom 0.254: v7.54,33.38 7.54,35.2 12.34,40.01 R7.1
N$28  (via drill 0.61)
  Top 0.254: v8.23,16 9.6,17.37 14.86,17.37 IC3.4
  Bottom 0.254: v8.23,16 9.14,15.09 IC2.3
N$29  (via drill 0.61)
  Top 0.254: v42.75,55.55 44.35,55.55 45.26,56.46 45.26,57.38 45.03,57.61 45.03,58.06 U2.2
  Bottom 0.254: v42.75,55.55 40.01,58.29 U$6.7
N$30  (via drill 0.61)
  Top 0.254: v44.35,56.92 44.35,58.06 U2.3
  Bottom 0.254: v44.35,56.92 U2.3 U$6.3
N$31  (via drill 0.61)
  Top 0.254: v43.66,60.35 43.66,58.29 U2.4
  Bottom 0.254: v43.66,60.35 43.2,60.35 42.29,59.44 42.29,58.52 U$6.5
N$32  (via drill 0.61)
  Top 0.254: v42.98,56.92 42.98,58.06 U2.5
  Bottom 0.254: v42.98,56.92 43.89,56.01 44.81,56.01 45.49,56.69 45.49,57.84 U$6.2
PD5  (via drill 0.61)
  Top 0.254: v37.95,36.8 37.95,38.63 U$1.22 | v41.15,34.06 40.46,34.06 33.6,27.2 33.15,27.2 32.69,26.75 v32.69,17.37 | v21.95,13.72 17.14,13.72 X3.2
  Bottom 0.254: v37.95,36.8 37.95,36.35 40.23,34.06 v41.15,34.06 | v32.69,17.37 29.72,17.37 26.06,13.72 v21.95,13.72
PD6  (via drill 0.61)
  Top 0.254: v47.32,40.23 44.81,42.75 40.01,42.75 U$1.26 | v48.23,13.95 48.23,10.97 44.81,7.54 35.43,7.54 27.43,15.54 15.09,15.54 3.89,4.34 2.74,4.34 X3.1
  Bottom 0.254: v47.32,40.23 49.61,37.95 50.29,37.95 50.98,37.26 50.98,31.32 49.38,29.72 49.15,29.72 48.23,28.8 v48.23,13.95
RESET  (via drill 0.61)
  Top 0.254: U$1.13 30.63,38.63 30.63,37.72 30.4,37.49 v25.38,37.49 25.38,32.92 v24.69,32.23 | v32.69,15.77 38.41,21.49 | 38.41,21.49 43.66,26.75 44.12,26.75 R1.1 | v32.69,8.91 28.12,4.34 X3.6 | 38.41,21.49 v33.6,26.29
  Bottom 0.254: v25.38,37.49 24.92,37.03 23.09,37.03 22.4,37.72 22.4,40.69 20.12,42.98 19.2,42.98 18.52,43.66 18.52,47.09 19.43,48.01 21.03,48.01 22.17,49.15 ISP1.5 | v32.69,8.91 v32.69,15.77 | v24.69,32.23 27.2,32.23 33.15,26.29 v33.6,26.29
SCK
  Top 0.254: 34.06,44.35 31.77,42.06 28.35,42.06 U$1.9 | 34.06,44.35 38.86,49.15 40.92,49.15 43.66,51.89 43.66,52.35 U2.11 | 34.06,44.35 29.26,49.15 26.29,49.15 24,46.86 22.4,46.86 ISP1.3
SS  (via drill 0.61)
  Top 0.254: v39.32,50.06 41.15,50.06 42.98,51.89 42.98,52.35 U2.10 | v29.95,42.98 28.35,42.98 U$1.8 | v46.41,32.46 46.41,29.95 49.15,27.2 50.29,27.2 51.21,26.29 51.21,10.29 47.55,6.63 42.75,6.63 38.18,2.06 17.14,2.06 15.09,4.12 12.8,4.12 X3.3
  Bottom 0.254: v39.32,50.06 37.95,48.69 37.95,45.49 37.49,45.03 32,45.03 31.55,44.58 31.55,43.66 34.06,41.15 37.49,41.15 37.95,40.69 37.95,39.78 37.49,39.32 37.03,39.32 | 37.03,39.32 33.6,39.32 v29.95,42.98 | v46.41,32.46 41.15,32.46 37.72,35.89 37.49,35.89 37.03,36.35 37.03,39.32
VCC  (via drill 0.61)
  Top 0.254: v40.01,35.66 38.86,35.66 38.18,34.98 v37.26,34.98
  Bottom 0.254: v40.01,35.66 41.15,36.8 49.61,36.8 JP1.4 | v37.26,34.98 36.58,34.98 35.2,33.6 35.2,33.38 34.98,33.15 22.63,33.15 IC4.3